# Altium schematic sheet 5_RF.SchDoc
size A4; SheetNumber: 5; SheetTotal: 5
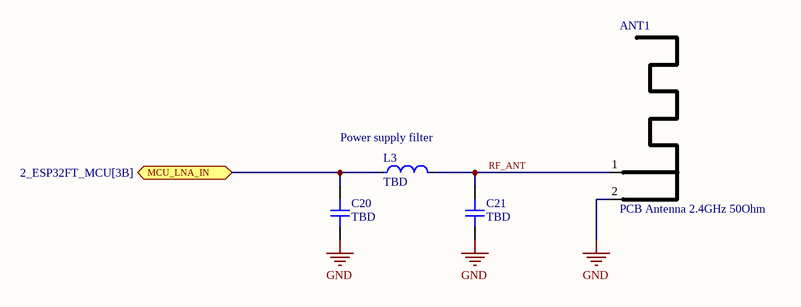
[diagram p0: 5_RF.SchDoc]

## Parts
ANT1  PCB Antenna 2.4GHz 50Ohm  [ANT_IFA_USB_2_4GHZ_50R]  (no BOM)
C20  TBD  [CAP_0402]
C21  TBD  [CAP_0402]
L3  TBD  [FP-LQW15AN_80-MFG]

## Ports
MCU_LNA_IN (bidir, see 2_ESP32FT_MCU[3B])

## Nets
GND: ANT1.2(GND) C20.1 C21.1
MCU_LNA_IN: C20.2 L3.1 ; port MCU_LNA_IN
RF_ANT: ANT1.1(RF) C21.2 L3.2

## Notes on the sheet
- (near L3) Power supply filter

## Library data of the parts
ANT1 = ANT_IFA_USB_2_4GHZ_50R: Inverted F 2.4GHz ISM PCB Antenna 50 Ohm; ComponentLink1Description: Datasheet; ComponentLink1URL: https://www.ti.com/lit/an/swra117d/swra117d.pdf
C20 C21 = CAP_0402_16V: Capacitor SMD 0402 16V; Supplier 1: Mouser; Supplier Part Number 1: 187-CL05A104KP5NNND
L3 = CMP-06042-014713-1: Wire Wound RF Inductor 2.2nH ±2% 2530mA 0.022Ω 0402 (1005)